# EAGLE design dali (EAGLE 9.3.0)
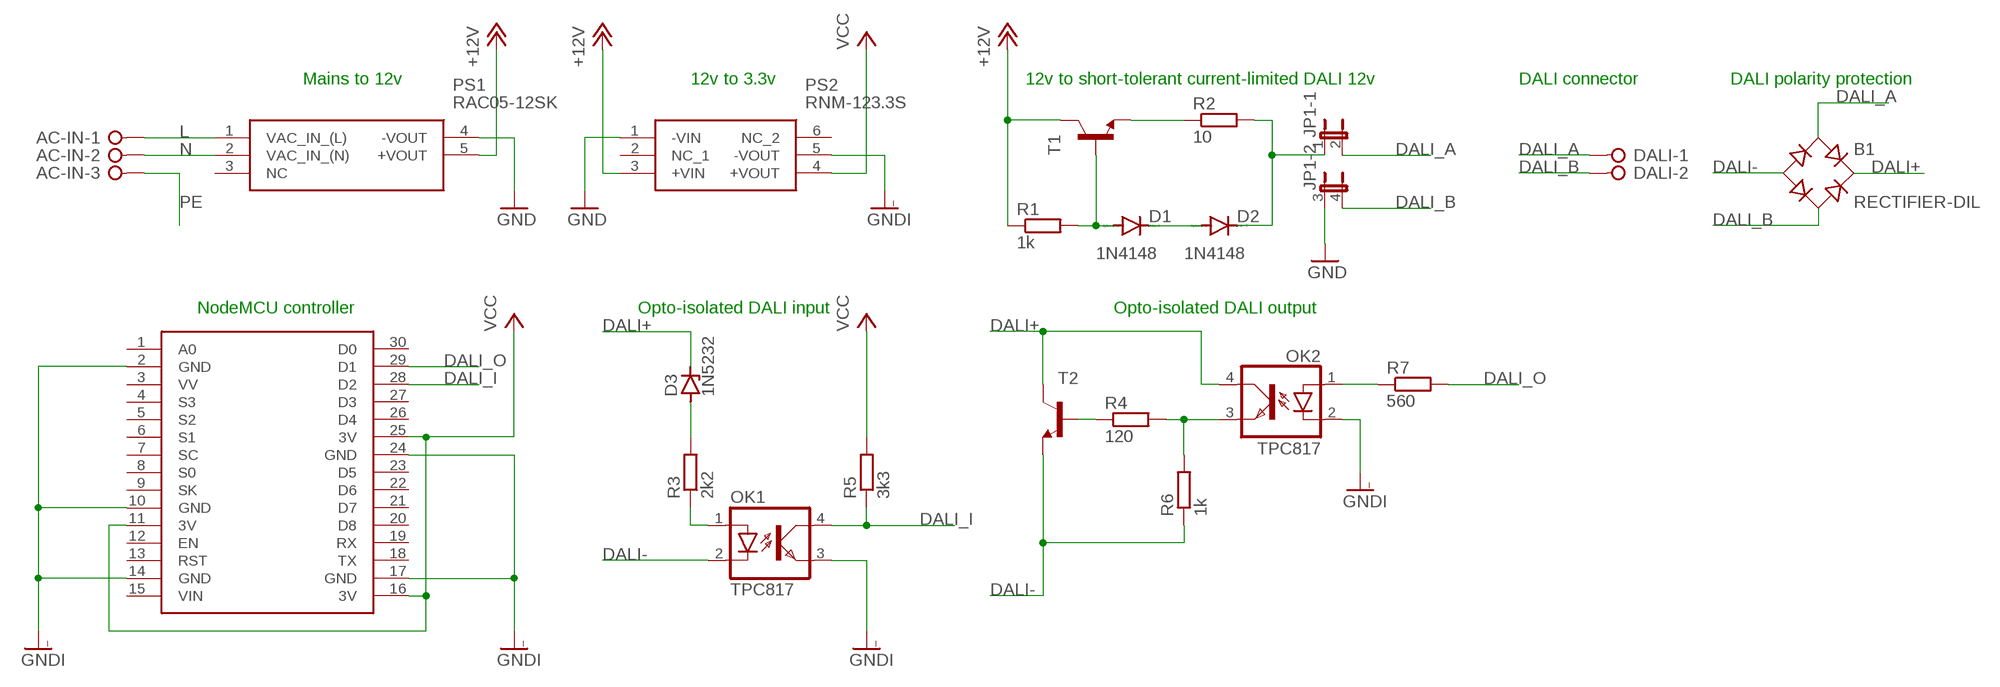
[diagram p0: schematic, sheet 1]

## Parts
AC-IN  39544-3003  [39544-3003]
B1  RECTIFIER-DIL  [B-DIL]
D1  1N4148  1N4148DO35-10  [DO35-10]
D2  1N4148  1N4148DO35-10  [DO35-10]
D3  1N5232  ZENER-DIODEDO35Z10  [DO35Z10]
DALI  39544-3002  [39544-3002]
JP1  JP2QE  [JP2Q]
OK1  TPC817  TIL191  [DIL04]
OK2  TPC817  TIL191  [DIL04]
PS1  RAC05-12SK  [RAC05-12SK]
PS2  RNM-123.3S  [DIP508W115P254L830H705Q6N]
R1  1k  R-EU_0207/7  [0207/7]
R2  10  R-EU_0207/7  [0207/7]
R3  2k2  R-EU_0207/7  [0207/7]
R4  120  R-EU_0207/7  [0207/7]
R5  3k3  R-EU_0207/7  [0207/7]
R6  1k  R-EU_0207/7  [0207/7]
R7  560  R-EU_0207/7  [0207/7]
T1  MPS2222A-NPN-TO92-CBE  [TO92-CBE]
T2  MPS2222A-NPN-TO92-CBE  [TO92-CBE]
U$1  NODEMCU  [NODEMCU]

## Nets
+12V: PS1.5(+VOUT) PS2.3(+VIN) R1.1 T1.C
DALI+: B1.+ D3.C OK2.4(COL) T2.C
DALI-: B1.- OK1.2(C) R6.1 T2.E
DALI_A: B1.AC1 DALI.1 JP1.2
DALI_B: B1.AC2 DALI.2 JP1.4
DALI_I: OK1.4(COL) R5.1 U$1.28(D2)
DALI_O: R7.2 U$1.29(D1)
GND: JP1.3 PS1.4(-VOUT) PS2.1(-VIN)
GNDI: OK1.3(EMIT) OK2.2(C) PS2.5(-VOUT) U$1.2(GND) U$1.10(GND) U$1.14(GND) U$1.17(GND) U$1.24(GND)
L: AC-IN.1 PS1.1(VAC_IN_(L))
N: AC-IN.2 PS1.2(VAC_IN_(N))
N$1: D1.A R1.2 T1.B
N$2: D1.C D2.A
N$3: R2.1 T1.E
N$4: D3.A R3.2
N$5: OK1.1(A) R3.1
N$6: R4.1 T2.B
N$7: OK2.3(EMIT) R4.2 R6.2
N$8: OK2.1(A) R7.1
N$9: D2.C JP1.1 R2.2
PE: AC-IN.3
VCC: PS2.4(+VOUT) R5.2 U$1.11(3V) U$1.16(3V) U$1.25(3V)
Unconnected: PS1.3(NC) PS2.2(NC_1) PS2.6(NC_2) U$1.1(A0) U$1.3(VV) U$1.4(S3) U$1.5(S2) U$1.6(S1) U$1.7(SC) U$1.8(S0) U$1.9(SK) U$1.12(EN) U$1.13(RST) U$1.15(VIN) U$1.18(TX) U$1.19(RX) U$1.20(D8) U$1.21(D7) U$1.22(D6) U$1.23(D5) U$1.26(D4) U$1.27(D3) U$1.30(D0)

## Notes on the sheet
- Mains to 12v | 12v to 3.3v | 12v to short-tolerant current-limited DALI 12v | DALI connector | DALI polarity protection
- NodeMCU controller | Opto-isolated DALI input | Opto-isolated DALI output

## Library data of the parts
AC-IN = jon:39544-3003: Molex 39544-3003 screw terminal; OC_FARNELL: unknown; OC_NEWARK: unknown
B1 = rectifier:RECTIFIER-: Rectifier
D1 D2 = diode:1N4148: DIODE high speed (Philips)
D3 = diode:ZENER-DIODE: Z-Diode
DALI = jon:39544-3002: Molex 39544-3002; OC_FARNELL: unknown; OC_NEWARK: unknown
JP1 = jumper:JP2QE: JUMPER
OK1 = optocoupler:TIL191: TEXAS INSTRUMENTS OPTO COUPLER; OC_FARNELL: 1683363; OC_NEWARK: unknown; SPICEPREFIX: O
OK2 = optocoupler:TIL191: TEXAS INSTRUMENTS OPTO COUPLER; OC_FARNELL: 1683363; OC_NEWARK: unknown
PS1 = SamacSys_Parts:RAC05-12SK: AC/DC Power Modules 5W 85-264Vin 12Vout 416mA 1x1in Source: Datasheet <https://componentsearchengine.com/Datasheets/1/RAC05-12SK.pdf>; DESCRIPTION: AC/DC Power Modules 5W 85-264Vin 12Vout 416mA 1x1in; HEIGHT: mm; MANUFACTURER_NAME: RECOM Power; MANUFACTURER_PART_NUMBER: RAC05-12SK; MOUSER_PART_NUMBER: 919-RAC05-12SK
PS2 = SamacSys_Parts:RNM-123.3S: Recom 1W Isolated DC-DC Converter, Vin 10.8 13.2 V dc, Vout 3.3V dc, I/O isolation 500V ac Source: Datasheet <https://www.mouser.de/datasheet/2/468/RNM-958271.pdf>; DESCRIPTION: Recom 1W Isolated DC-DC Converter, Vin 10.8 13.2 V dc, Vout 3.3V dc, I/O isolation 500V ac; HEIGHT: 7.05mm; MANUFACTURER_NAME: RECOM Power; MANUFACTURER_PART_NUMBER: RNM-123.3S
R1-R7 = rcl:R-EU_: RESISTOR, European symbol; SPICEPREFIX: R
T1 T2 = transistor:*-NPN-: NPN Transistror BF959 corrected 2008.03.06
U$1 = nodemcu:NODEMCU

## Board
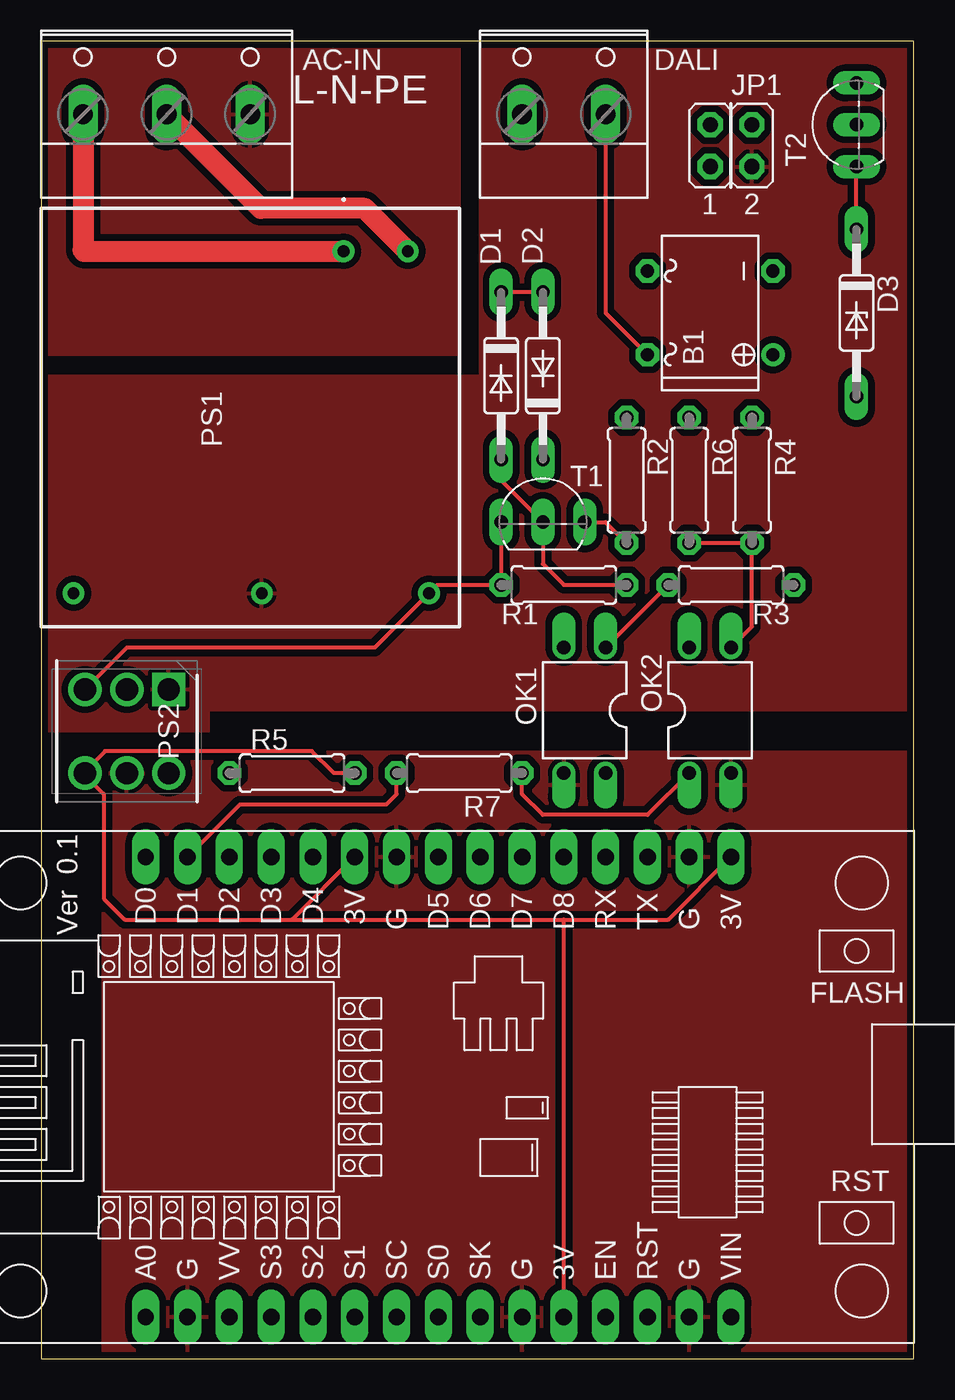
[diagram p1: board, top side]
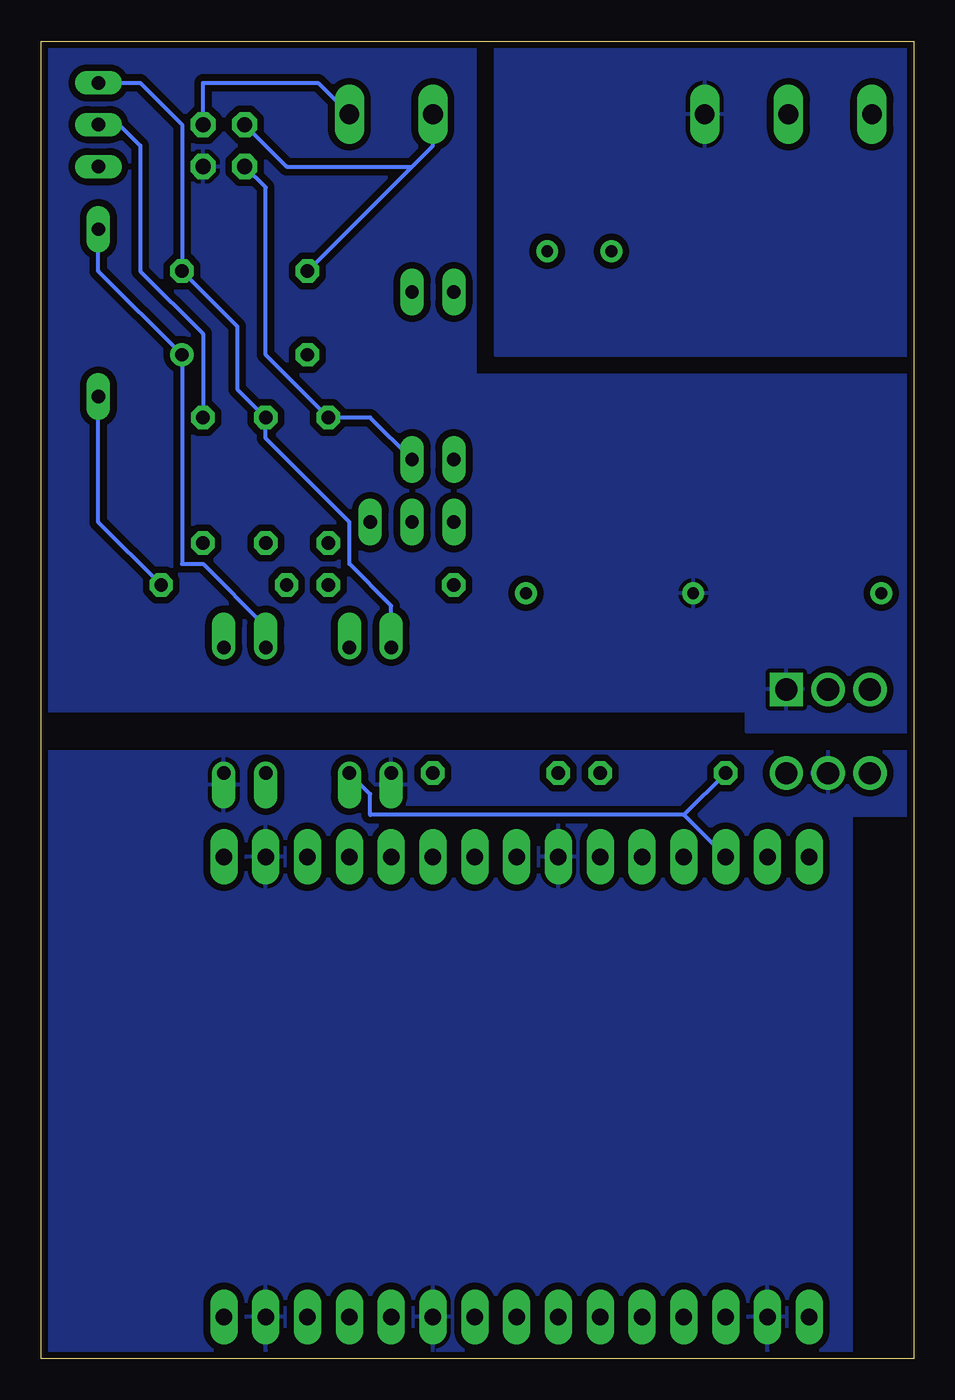
[diagram p2: board, bottom side, seen from below]

Size 53.01 x 80 mm. Coordinates in mm from the lower left corner, seen from the top.
Outline: 0,0 53.01,0 53.01,80 0,80 0,0
Copper layers (1*16): Top 0.035mm / dielectric 1.5mm / Bottom 0.035mm
Design rules "SparkFun *": minimum track width 10mil, minimum drill 20mil, track to track 8mil, track to pad 8mil, pad to pad 8mil, via to via 8mil, smd to smd 8mil, copper to edge 8mil, drill to drill 8mil, minimum pad ring 12mil, minimum via ring 10mil, stop-mask expansion 4mil, vias tented up to drill 20mil, thermal gap 10mil

### Footprints (pad centres in the part's own frame; a part is rotated, then mirrored left to right if it is on the bottom)
39544-3003 = drill 1.194 long: 1 -5.08,-0.635; 2 0,-0.635; 3 5.08,-0.635
B-DIL = drill 0.813: + -2.54,-3.81 | drill 0.813 octagon: - 2.54,-3.81; AC1 2.54,3.81; AC2 -2.54,3.81
DO35-10 = drill 0.813 long: A 5.08,0; C -5.08,0
DO35Z10 = drill 0.813 long: A 5.08,0; C -5.08,0
39544-3002 = drill 1.194 long: 1 -2.54,-0.635; 2 2.54,-0.635
JP2Q = drill 0.914 octagon: 1 -1.27,-1.27; 2 -1.27,1.27; 3 1.27,-1.27; 4 1.27,1.27
DIL04 = drill 0.813 offset: 1 -1.27,-3.81; 2 1.27,-3.81; 3 1.27,3.81; 4 -1.27,3.81
RAC05-12SK = drill 0.71 pad 1.21: 1 -22.79,-7.03; 2 -22.79,-3.13; 3 -2.03,-23.43; 4 -2.03,-12; 5 -2.03,-1.84
DIP508W115P254L830H705Q6N = drill 1.35 pad 1.75 square: 1 -2.54,2.54 | drill 1.35 pad 1.75: 2 -2.54,0; 3 -2.54,-2.54; 4 2.54,-2.54; 5 2.54,0; 6 2.54,2.54
0207/7 = drill 0.813 octagon: 1 -3.81,0; 2 3.81,0
TO92-CBE = drill 0.813 long: B 0,0; C -2.54,0; E 2.54,0
NODEMCU = drill 1 pad 1.676 long: 1 -13.97,17.78; 2 -13.97,15.24; 3 -13.97,12.7; 4 -13.97,10.16; 5 -13.97,7.62; 6 -13.97,5.08; 7 -13.97,2.54; 8 -13.97,0; 9 -13.97,-2.54; 10 -13.97,-5.08; 11 -13.97,-7.62; 12 -13.97,-10.16; 13 -13.97,-12.7; 14 -13.97,-15.24; 15 -13.97,-17.78; 16 13.97,-17.78; 17 13.97,-15.24; 18 13.97,-12.7; 19 13.97,-10.16; 20 13.97,-7.62; 21 13.97,-5.08; 22 13.97,-2.54; 23 13.97,0; 24 13.97,2.54; 25 13.97,5.08; 26 13.97,7.62; 27 13.97,10.16; 28 13.97,12.7; 29 13.97,15.24; 30 13.97,17.78

### Placement (x,y rotation side)
AC-IN  7.62,76.2 0 top
B1  40.64,63.5 90 top
D1  27.94,59.69 270 top
D2  30.48,59.69 90 top
D3  49.53,63.5 270 top
DALI  31.75,76.2 0 top
JP1  41.91,73.66 0 top
OK1  33.02,39.37 180 top
OK2  40.64,39.37 0 top
PS1  25.4,44.45 270 top
PS2  5.21,38.1 270 top
R1  31.75,46.99 0 top
R2  35.56,53.34 90 top
R3  41.91,46.99 0 top
R4  43.18,53.34 270 top
R5  15.24,35.56 0 top
R6  39.37,53.34 270 top
R7  25.4,35.56 180 top
T1  30.48,50.8 0 top
T2  49.53,74.93 90 top
U$1  24.13,16.51 90 top

### Tracks (layer width: path | path; a pad name or v marks a point on that pad's centre or on a via)
+12V
  Top 0.254: T1.C R1.1 24.07,46.99 PS1.5 20.26,43.18 5.21,43.18 PS2.3
DALI+
  Top 0.254: D3.C T2.C
  Bottom 0.254: D3.C 49.53,66.04 B1.+ 44.45,48.26 43.18,48.26 39.37,44.45 OK2.4
DALI-
  Bottom 0.254: OK1.2 31.75,45.72 34.29,48.26 34.29,50.8 39.37,55.88 R6.1 41.1,58.88 41.1,62.69 B1.- 44.45,74.93 46.99,77.47 T2.E
DALI_A
  Bottom 0.254: 30.48,72.39 29.21,73.66 DALI.1 | JP1.2 38.1,72.39 30.48,72.39 | B1.AC1 30.48,72.39
DALI_B
  Top 0.254: DALI.2 34.29,63.5 B1.AC2
  Bottom 0.254: JP1.4 43.18,77.47 36.2,77.47 DALI.2
DALI_I
  Bottom 0.254: R5.1 13.97,33.02 | OK1.4 33.02,34.29 33.02,33.02 13.97,33.02 | 13.97,33.02 U$1.28
DALI_O
  Top 0.254: R7.2 21.59,34.29 20.95,33.66 12.06,33.66 U$1.29
GND
  pour Top (isolate 0.406): 0,38.1 10.16,38.1 10.16,39.37 53.34,39.37 53.34,80.01 26.67,80.01 26.67,59.69 0,59.69
  pour Bottom (isolate 0.406): 26.67,80.01 53.34,80.01 53.34,39.37 10.16,39.37 10.16,38.1 0,38.1 0,59.69 26.67,59.69
GNDI
  pour Top (isolate 0.406): 53.34,0 3.81,0 3.81,33.02 0,33.02 0,36.83 53.34,36.83
  pour Bottom (isolate 0.406): 53.34,0 3.81,0 3.81,33.02 0,33.02 0,36.83 53.34,36.83
L
  Top 1.27: AC-IN.1 2.54,67.31 2.61,67.24 PS1.1
N
  Top 1.27: PS1.2 19.66,69.85 13.34,69.85 AC-IN.2
N$1
  Top 0.254: D1.A 27.94,53.34 T1.B 30.48,48.26 31.75,46.99 R1.2
N$2
  Top 0.254: D2.A D1.C
N$3
  Top 0.254: T1.E 34.29,50.8 R2.1
N$4
  Bottom 0.254: R3.2 49.53,50.8 D3.A
N$5
  Top 0.254: OK1.1 R3.1
N$6
  Bottom 0.254: R4.1 43.18,62.23 46.99,66.04 46.99,73.66 48.26,74.93 T2.B
N$7
  Top 0.254: OK2.3 43.18,44.45 R4.2 R6.2
N$8
  Top 0.254: OK2.1 36.83,33.02 30.48,33.02 29.21,34.29 R7.1
N$9
  Bottom 0.254: D2.C 33.02,57.15 R2.2 39.37,60.96 39.37,71.12 JP1.1
PE
  pour Top (isolate 0.406): 0,80.01 0,60.96 25.4,60.96 25.4,80.01
  pour Bottom (isolate 0.406): 0,80.01 25.4,80.01 25.4,60.96 0,60.96
VCC
  Top 0.254: R5.2 17.78,35.56 16.44,36.9 3.88,36.9 2.67,35.69 PS2.4 2.67,35.43 3.81,34.29 3.81,27.94 5.08,26.67 15.24,26.67 | 15.24,26.67 U$1.25 | 15.24,26.67 31.75,26.67 | 31.75,26.67 38.1,26.67 U$1.16 | U$1.11 31.75,26.67

### Text on the board
tNames: L-N-PE